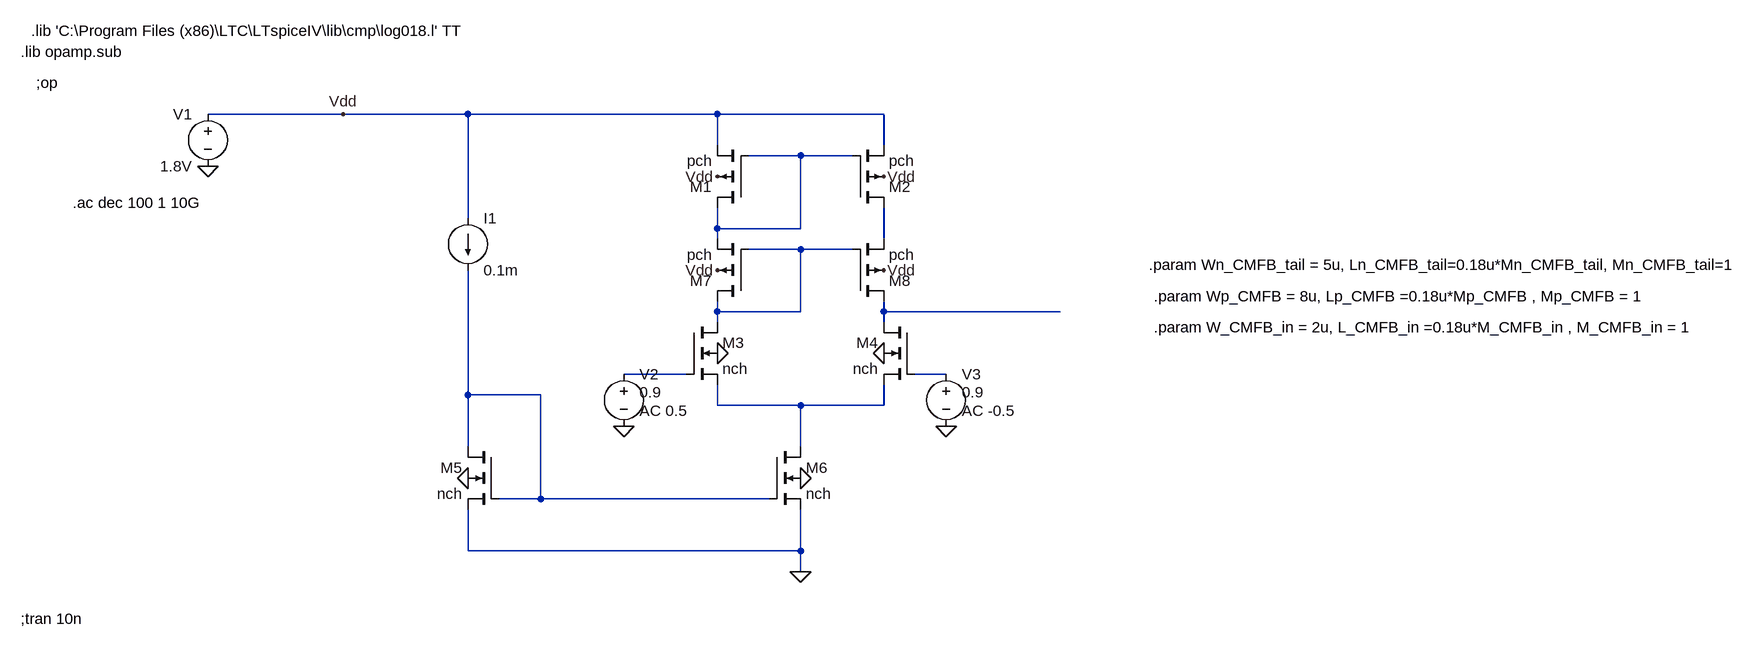
[diagram p0: schematic CMFB_Amplifier.asc]
CMFB_Amplifier.asc, the LTspice schematic file:
Version 4
SHEET 1 2044 852
WIRE -272 -256 -480 -256
WIRE -80 -256 -272 -256
WIRE 304 -256 -80 -256
WIRE 560 -256 304 -256
WIRE 304 -208 304 -256
WIRE 560 -208 560 -256
WIRE 432 -192 352 -192
WIRE 512 -192 432 -192
WIRE -80 -96 -80 -256
WIRE 304 -80 304 -112
WIRE 432 -80 432 -192
WIRE 432 -80 304 -80
WIRE 304 -64 304 -80
WIRE 560 -64 560 -112
WIRE 432 -48 352 -48
WIRE 512 -48 432 -48
WIRE 304 48 304 32
WIRE 432 48 432 -48
WIRE 432 48 304 48
WIRE 560 48 560 32
WIRE 640 48 560 48
WIRE 832 48 640 48
WIRE 304 64 304 48
WIRE 560 64 560 48
WIRE 256 144 160 144
WIRE 656 144 608 144
WIRE -80 176 -80 -16
WIRE 32 176 -80 176
WIRE 304 192 304 160
WIRE 432 192 304 192
WIRE 560 192 560 160
WIRE 560 192 432 192
WIRE -80 256 -80 176
WIRE 432 256 432 192
WIRE 32 336 32 176
WIRE 32 336 -32 336
WIRE 144 336 32 336
WIRE 384 336 144 336
WIRE -80 416 -80 352
WIRE 432 416 432 352
WIRE 432 416 -80 416
WIRE 432 448 432 416
FLAG -480 -176 0
FLAG -272 -256 Vdd
FLAG 304 -160 Vdd
FLAG 560 -160 Vdd
FLAG 304 112 0
FLAG 560 112 0
FLAG 432 448 0
FLAG 160 224 0
FLAG 656 224 0
FLAG 432 304 0
FLAG 304 -16 Vdd
FLAG 560 -16 Vdd
FLAG -80 304 0
DATAFLAG 432 192 "round($*1000)/1000"
DATAFLAG 480 240 "round(Id(M6)*100000000)/100000000"
DATAFLAG 144 336 ""
DATAFLAG 640 48 "round($*1000)/1000"
DATAFLAG 432 -48 "round($*1000)/1000"
DATAFLAG 432 -192 "round($*1000)/1000"
DATAFLAG 608 -80 "round(-Id(M2)*100000000)/100000000"
SYMBOL Overige\ componenten\\voltage -480 -272 M0
WINDOW 123 0 0 Left 2
WINDOW 39 0 0 Left 2
SYMATTR InstName V1
SYMATTR Value 1.8V
SYMBOL Overige\ componenten\\pmos4 352 -112 R180
SYMATTR InstName M1
SYMATTR Value pch
SYMATTR Value2 l={Lp_CMFB} w={Wp_CMFB} m={Mp_CMFB}
SYMBOL Overige\ componenten\\pmos4 512 -112 M180
SYMATTR InstName M2
SYMATTR Value pch
SYMATTR Value2 l={Lp_CMFB} w={Wp_CMFB} m={Mp_CMFB}
SYMBOL nmos4 256 64 R0
SYMATTR InstName M3
SYMATTR Value nch
SYMATTR Value2 l={L_CMFB_in} w={W_CMFB_in} m={M_CMFB_in}
SYMBOL nmos4 608 64 M0
SYMATTR InstName M4
SYMATTR Value nch
SYMATTR Value2 l={L_CMFB_in} w={W_CMFB_in} m={M_CMFB_in}
SYMBOL Overige\ componenten\\voltage 160 128 R0
WINDOW 3 24 44 Left 2
WINDOW 123 24 72 Left 2
WINDOW 39 0 0 Left 2
SYMATTR Value 0.9
SYMATTR Value2 AC 0.5
SYMATTR InstName V2
SYMBOL Overige\ componenten\\voltage 656 128 R0
WINDOW 3 24 44 Left 2
WINDOW 123 24 72 Left 2
WINDOW 39 0 0 Left 2
SYMATTR Value 0.9
SYMATTR Value2 AC -0.5
SYMATTR InstName V3
SYMBOL nmos4 384 256 R0
SYMATTR InstName M6
SYMATTR Value nch
SYMATTR Value2 l={Ln_CMFB_tail} w={Wn_CMFB_tail} m={Mn_CMFB_tail}
SYMBOL Overige\ componenten\\pmos4 352 32 R180
SYMATTR InstName M7
SYMATTR Value pch
SYMATTR Value2 l={Lp_CMFB} w={Wp_CMFB} m={Mp_CMFB}
SYMBOL Overige\ componenten\\pmos4 512 32 M180
SYMATTR InstName M8
SYMATTR Value pch
SYMATTR Value2 l={Lp_CMFB} w={Wp_CMFB} m={Mp_CMFB}
SYMBOL current -80 -96 R0
WINDOW 123 0 0 Left 2
WINDOW 39 0 0 Left 2
SYMATTR InstName I1
SYMATTR Value 0.1m
SYMBOL nmos4 -32 256 M0
SYMATTR InstName M5
SYMATTR Value nch
SYMATTR Value2 l={Ln_CMFB_tail} w={Wn_CMFB_tail} m={Mn_CMFB_tail}
TEXT -752 -384 Left 2 !.lib 'C:\\Program Files (x86)\\LTC\\LTspiceIV\\lib\\cmp\\log018.l' TT
TEXT -768 -352 Left 2 !.lib opamp.sub
TEXT -744 -304 Left 2 !;op
TEXT -768 520 Left 2 !;tran 10n
TEXT 968 -24 Left 2 !.param Wn_CMFB_tail = 5u, Ln_CMFB_tail=0.18u*Mn_CMFB_tail, Mn_CMFB_tail=1
TEXT 976 24 Left 2 !.param Wp_CMFB = 8u, Lp_CMFB =0.18u*Mp_CMFB , Mp_CMFB = 1
TEXT 976 72 Left 2 !.param W_CMFB_in = 2u, L_CMFB_in =0.18u*M_CMFB_in , M_CMFB_in = 1
TEXT -688 -120 Left 2 !.ac dec 100 1 10G

The netlist it stands for:
* CMFB_Amplifier.asc
V1 Vdd 0 1.8V
M1 N001 N001 Vdd Vdd pch l={Lp_CMFB} w={Wp_CMFB} m={Mp_CMFB}
M2 N002 N001 Vdd Vdd pch l={Lp_CMFB} w={Wp_CMFB} m={Mp_CMFB}
M3 N003 N005 N008 0 nch l={L_CMFB_in} w={W_CMFB_in} m={M_CMFB_in}
M4 N004 N006 N008 0 nch l={L_CMFB_in} w={W_CMFB_in} m={M_CMFB_in}
V2 N005 0 0.9 AC 0.5
V3 N006 0 0.9 AC -0.5
M6 N008 N007 0 0 nch l={Ln_CMFB_tail} w={Wn_CMFB_tail} m={Mn_CMFB_tail}
M7 N003 N003 N001 Vdd pch l={Lp_CMFB} w={Wp_CMFB} m={Mp_CMFB}
M8 N004 N003 N002 Vdd pch l={Lp_CMFB} w={Wp_CMFB} m={Mp_CMFB}
I1 Vdd N007 0.1m
M5 N007 N007 0 0 nch l={Ln_CMFB_tail} w={Wn_CMFB_tail} m={Mn_CMFB_tail}
.model NMOS NMOS
.model PMOS PMOS
.lib standard.mos
.lib 'C:\Program Files (x86)\LTC\LTspiceIV\lib\cmp\log018.l' TT
.lib opamp.sub
;op
;tran 10n
.param Wn_CMFB_tail = 5u, Ln_CMFB_tail=0.18u*Mn_CMFB_tail, Mn_CMFB_tail=1
.param Wp_CMFB = 8u, Lp_CMFB =0.18u*Mp_CMFB , Mp_CMFB = 1
.param W_CMFB_in = 2u, L_CMFB_in =0.18u*M_CMFB_in , M_CMFB_in = 1
.ac dec 100 1 10G
.backanno
.end